# Altium schematic sheet [03] TOP LEVEL.SchDoc
size A3; CheckedBy: R. LIPAR; Author: R. LIPAR; CompanyName: Pelinci; DrawnBy: R. LIPAR; Engineer: R. LIPAR; Organization: Pelinci; Address2: SI-4208 Sencur; Address3: Slovenia
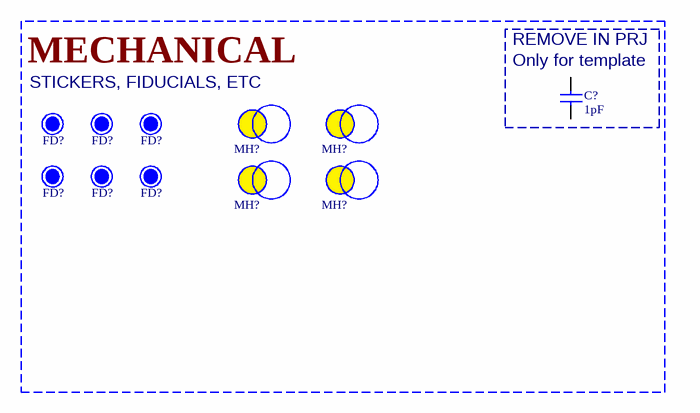
[diagram p0: [03] TOP LEVEL.SchDoc]

## Parts
(Parts that share a designator on the sheet are numbered #1, #2 ... from top to bottom, then left to right.)
C?  value 1pF  [CAP 0402-R1]  (hidden comment: CAP 1pF 50V NP0 0402)
FD?#1  FIDUCIAL O  [FIDUCIAL-FUTURIT]  (value not drawn)  (no BOM)
FD?#2  FIDUCIAL O  [FIDUCIAL-FUTURIT]  (value not drawn)  (no BOM)
FD?#3  FIDUCIAL O  [FIDUCIAL-FUTURIT]  (value not drawn)  (no BOM)
FD?#4  FIDUCIAL O  [FIDUCIAL-FUTURIT]  (value not drawn)  (no BOM)
FD?#5  FIDUCIAL O  [FIDUCIAL-FUTURIT]  (value not drawn)  (no BOM)
FD?#6  FIDUCIAL O  [FIDUCIAL-FUTURIT]  (value not drawn)  (no BOM)
MH?#1  Hole_3mm  [Hole_3mm]  (value not drawn)
MH?#2  Hole_3mm  [Hole_3mm]  (value not drawn)
MH?#3  Hole_3mm  [Hole_3mm]  (value not drawn)
MH?#4  Hole_3mm  [Hole_3mm]  (value not drawn)

## Nets

Not connected (* = marked no-connect by the designer): C? 1 2

## Notes on the sheet
- (near FD?#1) STICKERS, FIDUCIALS, ETC
- (near FD?#2) MECHANICAL
- (near C?) REMOVE IN PRJ
- (near C?) Only for template
- Variant:
- Title:
- SCH Revision:
- SCH Name:
- SCH date:
- Date:
- Code:
- Sheet:
- of
- Size:
- A3
- DrawnBy:
- CheckedBy:
- Document name:
- Revision:
- Any illegal copying and transfer of this document to third party is strictly forbidden

## Library data of the parts
C? = CAP 1pF 50V NP0 0402: CAP CEC 1pF 50V +/-0.1pF 0402; Component_ID: 205500046000; DC Bias: NO; Part ID: 14650; Type: NPO 0402; ComponentLink1Description: Datasheet; ComponentLink1URL: \\RNDPD01\CAE\DATASHEET\CAP\Murata CCM capacitors.pdf; Voltage: 50V; ComponentLink4Description: Datasheet - DC Bias; ComponentLink9Description: PRF; ComponentLink9URL: \\rndpd01\CAE\Part_Request\205500046000.pdf